# Altium schematic sheet MCU_and_Antenna.SchDoc (part 1 of 2)
size A4; Organization: My Company; Address1: Address Line 1; Address2: Address Line 2; Address3: Address Line 3; Address4: Address Line 4; SheetNumber: 4; SheetTotal: 6
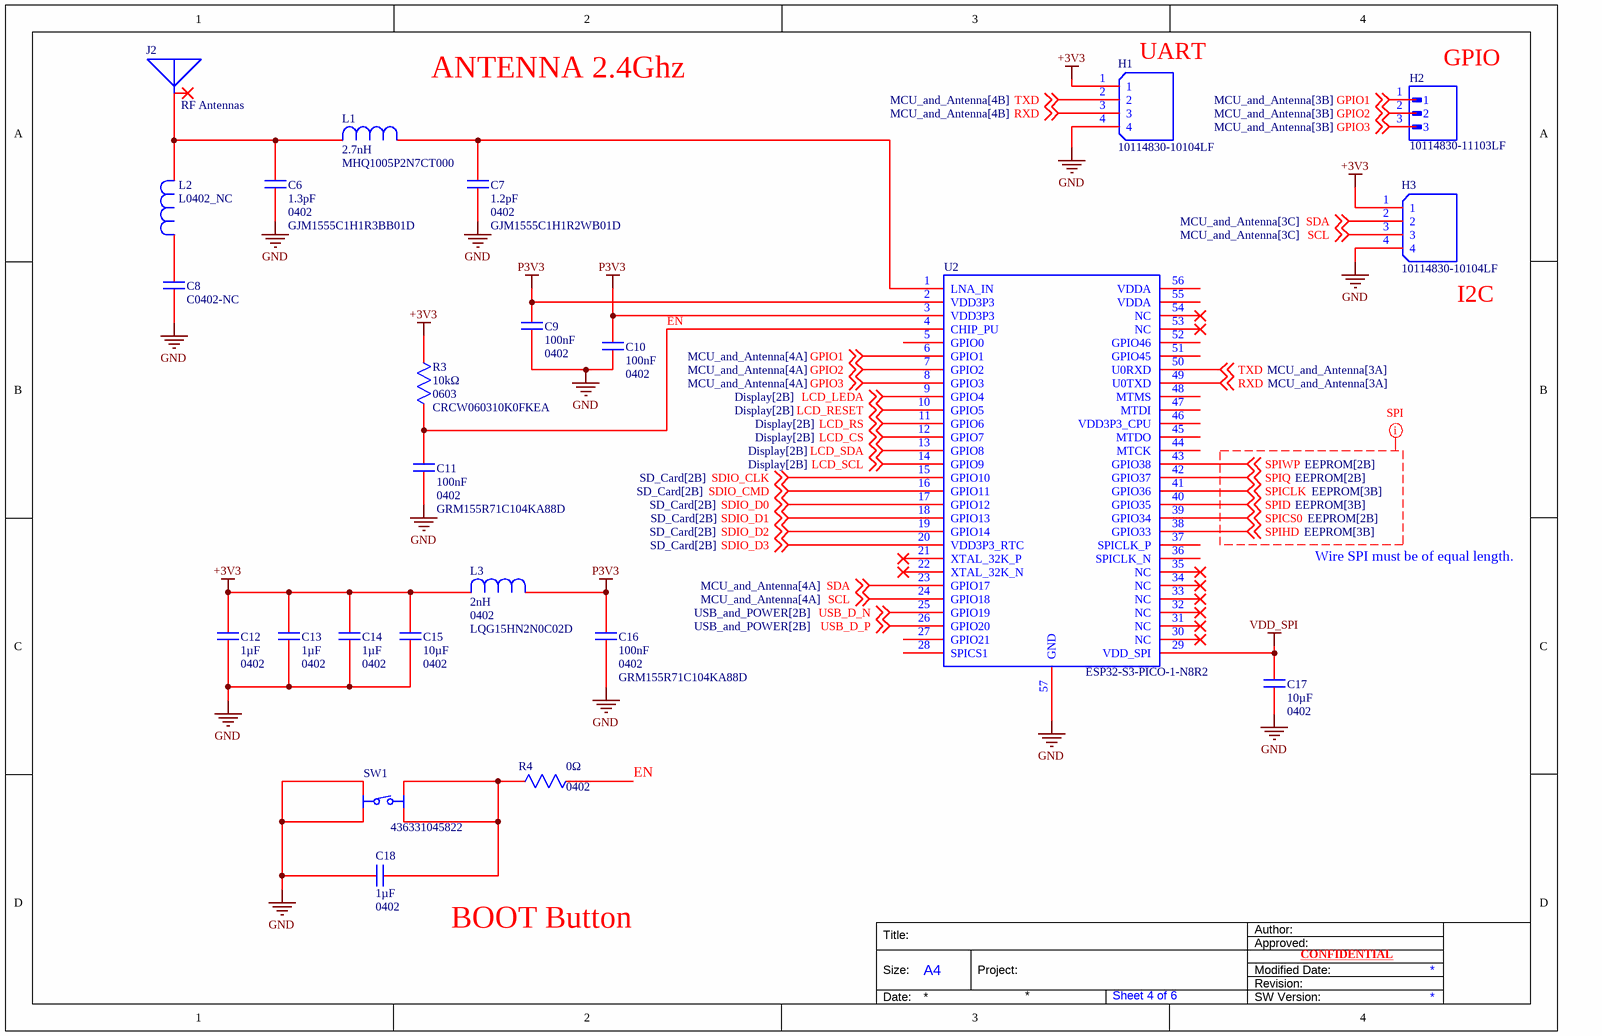
[diagram p0: MCU_and_Antenna.SchDoc]

## Parts
C6  GJM1555C1H1R3BB01D  value 1.3pF  Case Code (Imperial): 0402  [CAPC1005X55N]
C7  GJM1555C1H1R2WB01D  value 1.2pF  Case/Package: 0402  [CAPC1005X55N]
C8  C0402-NC  [CAPC1005X55N - NC]
C9  value 100nF  Case/Package: 0402  [CAPC1005X55N]  (hidden comment: GRM155R71C104KA88D)
C10  value 100nF  Case/Package: 0402  [CAPC1005X55N]  (hidden comment: GRM155R71C104KA88D)
C11  GRM155R71C104KA88D  value 100nF  Case/Package: 0402  [CAPC1005X55N]
C12  value 1µF  Case/Package: 0402  [CAPC1005X55N]  (hidden comment: CL05A105KP5NNNC)
C13  value 1µF  Case/Package: 0402  [CAPC1005X55N]  (hidden comment: CL05A105KP5NNNC)
C14  value 1µF  Case/Package: 0402  [CAPC1005X55N]  (hidden comment: CL05A105KP5NNNC)
C15  value 10µF  Case/Package: 0402  [CAPC1005X55N]  (hidden comment: GRM155R60J106ME15D)
C16  GRM155R71C104KA88D  value 100nF  Case/Package: 0402  [CAPC1005X55N]
C17  value 10µF  Case/Package: 0402  [CAPC1005X55N]  (hidden comment: GRM155R60J106ME15D)
C18  value 1µF  Case/Package: 0402  [CAPC1005X55N]  (hidden comment: CL05A105KP5NNNC)
H1  10114830-10104LF  [AMPHENOL_10114830-10104LF]
H2  10114830-11103LF  [AMPHENOL_10114830-11103LF]
H3  10114830-10104LF  [AMPHENOL_10114830-10104LF]
J2  RF Antennas  [ANT3216LL00R2400A]
L1  MHQ1005P2N7CT000  value 2.7nH  [IND_1005_TDK]
L2  L0402_NC  [IND_1005_TDK_NC]
L3  LQG15HN2N0C02D  value 2nH  Case/Package: 0402  [INDC1005X55N]
R3  CRCW060310K0FKEA  value 10kΩ  Case Code (Imperial): 0603  [RES_CRCW_0603]
R4  value 0Ω  Case/Package: 0402  [RC0402N_YAG-M]  (hidden comment: RC0402JR-070RL)
SW1  436331045822  [436331045822]
U2  ESP32-S3-PICO-1-N8R2  [QFN56_7X7_EXP-L]

## Nets
+3V3: C12.2 C13.2 C14.2 C15.2 H1.1 H3.1 L3.2 R3.1
GND: C6.1 C7.1 C8.1 C9.2 C10.2 C11.2 C12.1 C13.1 C14.1 C15.1 C16.2 C17.1 C18.2 H1.4 H3.4 SW1.1 SW1.3 U2.57(GND)
P3V3: C9.1 C10.1 C16.1 L3.1 U2.2(VDD3P3) U2.3(VDD3P3)
VDD_SPI: C17.2 U2.29(VDD_SPI)
EN: C11.1 R3.2 R4.2 U2.4(CHIP_PU)
GPIO1: H2.1 U2.6(GPIO1) ; off-sheet GPIO1
GPIO2: H2.2 U2.7(GPIO2) ; off-sheet GPIO2
GPIO3: H2.3 U2.8(GPIO3) ; off-sheet GPIO3
LCD_CS: U2.12(GPIO7) ; off-sheet LCD_CS
LCD_LEDA: U2.9(GPIO4) ; off-sheet LCD_LEDA
LCD_RESET: U2.10(GPIO5) ; off-sheet LCD_RESET
LCD_RS: U2.11(GPIO6) ; off-sheet LCD_RS
LCD_SCL: U2.14(GPIO9) ; off-sheet LCD_SCL
LCD_SDA: U2.13(GPIO8) ; off-sheet LCD_SDA
RXD: H1.3 U2.49(U0TXD) ; off-sheet RXD
SCL: H3.3 U2.24(GPIO18) ; off-sheet SCL
SDA: H3.2 U2.23(GPIO17) ; off-sheet SDA
SDIO_CLK: U2.15(GPIO10) ; off-sheet SDIO_CLK
SDIO_CMD: U2.16(GPIO11) ; off-sheet SDIO_CMD
SDIO_D0: U2.17(GPIO12) ; off-sheet SDIO_D0
SDIO_D1: U2.18(GPIO13) ; off-sheet SDIO_D1
SDIO_D2: U2.19(GPIO14) ; off-sheet SDIO_D2
SDIO_D3: U2.20(VDD3P3_RTC) ; off-sheet SDIO_D3
SPICLK: U2.41(GPIO36) ; off-sheet SPICLK
SPICS0: U2.39(GPIO34) ; off-sheet SPICS0
SPID: U2.40(GPIO35) ; off-sheet SPID
SPIHD: U2.38(GPIO33) ; off-sheet SPIHD
SPIQ: U2.42(GPIO37) ; off-sheet SPIQ
SPIWP: U2.43(GPIO38) ; off-sheet SPIWP
TXD: H1.2 U2.50(U0RXD) ; off-sheet TXD
USB_D_N: U2.25(GPIO19) ; off-sheet USB_D_N
USB_D_P: U2.26(GPIO20) ; off-sheet USB_D_P
NetC6_2: C6.2 J2.1 L1.2 L2.1
NetC7_2: C7.2 L1.1 U2.1(LNA_IN)
NetC8_2: C8.2 L2.2
NetC18_1: C18.1 R4.1 SW1.2 SW1.4

Not connected (* = marked no-connect by the designer): J2 2*; U2 5(GPIO0) 21(XTAL_32K_P)* 22(XTAL_32K_N)* 27(GPIO21) 28(SPICS1) 30(NC)* 31(NC)* 32(NC)* 33(NC)* 34(NC)* 35(NC)* 36(SPICLK_N) 37(SPICLK_P) 44(MTCK) 45(MTDO) 46(VDD3P3_CPU) 47(MTDI) 48(MTMS) 51(GPIO45) 52(GPIO46) 53(NC)* 54(NC)* 55(VDDA) 56(VDDA)

## Layout directives
mark named SPI: SPICLK, SPICS0, SPID, SPIHD, SPIQ, SPIWP

## Notes on the sheet
- ANTENNA 2.4Ghz
- (near H1) UART
- (near H2) GPIO
- I2C
- Wire SPI must be of equal length.
- BOOT Button
- Author:
- Title:
- Size:
- A4
- Project:
- Approved:
- Revision:
- Modified Date:
- CONFIDENTIAL
- Date:
- SW Version:
## Library data of the parts
C6 = GJM1555C1H1R3BB01D: 50V 1.3pF C0G 0402 Multilayer Ceramic Capacitors MLCC - SMD/SMT ROHS; Manufacturer: Murata; Manufacturer Lifecycle Status: IN PRODUCTION; Temperature Coefficient: 30ppm/°C; Supplier: DigiKey; Supplier Part Number: 490-8086-1-ND; Manufacturer Part Number: GJM1555C1H1R3BB01D; RoHS: Compliant; Category: Ceramic Capacitors; Stock: 147628; Pricing: 1=0,1, 10=0,051, 50=0,035, 100=0,0302, 500=0,02198, 1000=0,01946, 2500=0,01682, 5000=0,01524 (USD); Case/Package: 0402; Case Code (Metric): 1005; Depth: 500µm; Dielectric: C0G; Dielectric Material: Ceramic; Export Control Classification Number (ECCN) Code: EAR99; Height: 500µm; Harmonized Tariff Schedule (HTS) Code: 8532.24.00.20; Introduction Date: 2008-02-22; Lead Free: Lead Free; Lead Pitch: 300µm; Length: 1mm; Lifecycle Status: Production; Material: Ceramic; Max Operating Temperature: 125°C; Min Operating Temperature: -55°C; Mounting Technology: Surface Mount; Pins: 2; Number of Terminals: 2; Radiation Hardening: No; REACH SVHC: Yes; Schedule B: 8532240020, 8532240020|8532240020|8532240020|8532240020|8532240020; Termination: SMD/SMT; Thickness: 500µm; Voltage Rating: 50V; Voltage Rating (DC): 50V; Width: 500µm; ComponentLink1URL: https://datasheet.octopart.com:443/GJM1555C1H1R3BB01D-Murata-datasheet-12515636.pdf?src-supplier=_legacy+Avnet; ComponentLink1Description: https://datasheet.octopart.com:443/GJM1555C1H1R3BB01D-Murata-datasheet-12515636.pdf?src-supplier=_legacy+Avnet; ComponentLink2URL: https://datasheet.octopart.com:443/GJM1555C1H1R3BB01D-Murata-datasheet-165579666.pdf?src-supplier=TME; ComponentLink2Description: https://datasheet.octopart.com:443/GJM1555C1H1R3BB01D-Murata-datasheet-165579666.pdf?src-supplier=TME; ComponentLink3URL: https://datasheet.octopart.com:443/GJM1555C1H1R3BB01D-Murata-datasheet-12511495.pdf?src-supplier=TME; ComponentLink3Description: https://datasheet.octopart.com:443/GJM1555C1H1R3BB01D-Murata-datasheet-12511495.pdf?src-supplier=TME; ComponentLink4URL: https://datasheet.octopart.com:443/GJM1555C1H1R3BB01D-Murata-datasheet-141266224.pdf?src-supplier=Ciiva; ComponentLink4Description: https://datasheet.octopart.com:443/GJM1555C1H1R3BB01D-Murata-datasheet-141266224.pdf?src-supplier=Ciiva; ComponentLink5URL: https://datasheet.octopart.com:443/GJM1555C1H1R3BB01D-Murata-datasheet-140665301.pdf?src-supplier=Ciiva; ComponentLink5Description: https://datasheet.octopart.com:443/GJM1555C1H1R3BB01D-Murata-datasheet-140665301.pdf?src-supplier=Ciiva; ComponentLink6URL: https://datasheet.octopart.com:443/GJM1555C1H1R3BB01D-Murata-datasheet-138724564.pdf?src-supplier=Ciiva; ComponentLink6Description: https://datasheet.octopart.com:443/GJM1555C1H1R3BB01D-Murata-datasheet-138724564.pdf?src-supplier=Ciiva; ComponentLink7URL: https://datasheet.octopart.com:443/GJM1555C1H1R3BB01D-Murata-datasheet-22122223.pdf?src-supplier=Future+Electronics; ComponentLink7Description: https://datasheet.octopart.com:443/GJM1555C1H1R3BB01D-Murata-datasheet-22122223.pdf?src-supplier=Future+Electronics; ComponentLink8URL: https://datasheet.octopart.com:443/GJM1555C1H1R3BB01D-Murata-datasheet-12510170.pdf?src-supplier=Future+Electronics; ComponentLink8Description: https://datasheet.octopart.com:443/GJM1555C1H1R3BB01D-Murata-datasheet-12510170.pdf?src-supplier=Future+Electronics; ComponentLink9URL: https://datasheet.octopart.com:443/GJM1555C1H1R3BB01D-Murata-datasheet-8517407.pdf?src-supplier=Future+Electronics; ComponentLink9Description: https://datasheet.octopart.com:443/GJM1555C1H1R3BB01D-Murata-datasheet-8517407.pdf?src-supplier=Future+Electronics; ComponentLink10URL: https://datasheet.octopart.com:443/GJM1555C1H1R3BB01D-Murata-datasheet-8387045.pdf?src-supplier=Future+Electronics; ComponentLink10Description: https://datasheet.octopart.com:443/GJM1555C1H1R3BB01D-Murata-datasheet-8387045.pdf?src-supplier=Future+Electronics; ComponentLink11URL: https://datasheet.octopart.com:443/GJM1555C1H1R3BB01D-Murata-datasheet-8324201.pdf?src-supplier=Future+Electronics; ComponentLink11Description: https://datasheet.octopart.com:443/GJM1555C1H1R3BB01D-Murata-datasheet-8324201.pdf?src-supplier=Future+Electronics; ComponentLink12URL: https://datasheet.octopart.com:443/GJM1555C1H1R3BB01D-Murata-datasheet-7628724.pdf?src-supplier=Future+Electronics; ComponentLink12Description: https://datasheet.octopart.com:443/GJM1555C1H1R3BB01D-Murata-datasheet-7628724.pdf?src-supplier=Future+Electronics; ComponentLink13URL: https://datasheet.octopart.com:443/GJM1555C1H1R3BB01D-Murata-datasheet-552801.pdf?src-supplier=Future+Electronics; ComponentLink13Description: https://datasheet.octopart.com:443/GJM1555C1H1R3BB01D-Murata-datasheet-552801.pdf?src-supplier=Future+Electronics; ComponentLink14URL: https://datasheet.octopart.com:443/GJM1555C1H1R3BB01D-Murata-datasheet-44781245.pdf?src-supplier=Future+Electronics; ComponentLink14Description: https://datasheet.octopart.com:443/GJM1555C1H1R3BB01D-Murata-datasheet-44781245.pdf?src-supplier=Future+Electronics; ComponentLink15URL: https://datasheet.octopart.com/GJM1555C1H1R3BB01D-Murata-datasheet-12515295.pdf; ComponentLink15Description: https://datasheet.octopart.com/GJM1555C1H1R3BB01D-Murata-datasheet-12515295.pdf; ComponentLink16URL: https://datasheet.octopart.com/GJM1555C1H1R3BB01D-Murata-datasheet-12510076.pdf; ComponentLink16Description: https://datasheet.octopart.com/GJM1555C1H1R3BB01D-Murata-datasheet-12510076.pdf; ComponentLink17URL: https://datasheet.octopart.com/GJM1555C1H1R3BB01D-Murata-datasheet-11978611.pdf; ComponentLink17Description: https://datasheet.octopart.com/GJM1555C1H1R3BB01D-Murata-datasheet-11978611.pdf; ComponentLink18URL: https://datasheet.octopart.com/GJM1555C1H1R3BB01D-Murata-datasheet-10025737.pdf; ComponentLink18Description: https://datasheet.octopart.com/GJM1555C1H1R3BB01D-Murata-datasheet-10025737.pdf; ComponentLink19URL: https://datasheet.octopart.com/GJM1555C1H1R3BB01D-Murata-datasheet-8819587.pdf; ComponentLink19Description: https://datasheet.octopart.com/GJM1555C1H1R3BB01D-Murata-datasheet-8819587.pdf; ComponentLink20URL: https://datasheet.octopart.com/GJM1555C1H1R3BB01D-Murata-datasheet-14405988.pdf; ComponentLink20Description: https://datasheet.octopart.com/GJM1555C1H1R3BB01D-Murata-datasheet-14405988.pdf; ComponentLink21URL: https://datasheet.octopart.com:443/GJM1555C1H1R3BB01D-Murata-datasheet-10124241.pdf?src-supplier=Farnell; ComponentLink21Description: https://datasheet.octopart.com:443/GJM1555C1H1R3BB01D-Murata-datasheet-10124241.pdf?src-supplier=Farnell; ComponentLink22URL: http://sigma.octopart.com:80/reach_statement/Murata-company-16.pdf?src-supplier=Compliance+Statements; ComponentLink22Description: http://sigma.octopart.com:80/reach_statement/Murata-company-16.pdf?src-supplier=Compliance+Statements; LCSC Part: C161309
C7 = GJM1555C1H1R2WB01D: 50V 1.2pF C0G 0402 Multilayer Ceramic Capacitors MLCC - SMD/SMT ROHS; Manufacturer: Murata; Manufacturer Lifecycle Status: IN PRODUCTION; Temperature Coefficient: 30ppm/°C; Supplier: DigiKey; Supplier Part Number: 490-11195-1-ND; Manufacturer Part Number: GJM1555C1H1R2WB01D; RoHS: Compliant; Category: Ceramic Capacitors; Stock: 139087; Pricing: 1=0,14, 10=0,076, 50=0,0532, 100=0,0462, 500=0,0344, 1000=0,03078, 2500=0,02696, 5000=0,02467 (USD); Case Code (Imperial): 0402; Case Code (Metric): 1005; Depth: 500µm; Dielectric: C0G; Dielectric Material: Ceramic; Export Control Classification Number (ECCN) Code: EAR99; Height: 500µm; Harmonized Tariff Schedule (HTS) Code: 8532.24.00.20; Introduction Date: 2008-02-22; Lead Free: Lead Free; Length: 1mm; Lifecycle Status: Production; Material: Ceramic; Max Operating Temperature: 125°C; Min Operating Temperature: -55°C; Mounting Technology: Surface Mount; Number of Terminals: 2; Radiation Hardening: No; REACH SVHC: Yes; Schedule B: 8532240020, 8532240020|8532240020|8532240020|8532240020|8532240020; Termination: SMD/SMT; Thickness: 500µm; Voltage: 50V; Voltage Rating: 50V; Voltage Rating (DC): 50V; Width: 500µm; ComponentLink1URL: https://datasheet.octopart.com:443/GJM1555C1H1R2WB01D-Murata-datasheet-96711496.pdf?src-supplier=element14+APAC; ComponentLink1Description: https://datasheet.octopart.com:443/GJM1555C1H1R2WB01D-Murata-datasheet-96711496.pdf?src-supplier=element14+APAC; ComponentLink2URL: https://datasheet.octopart.com:443/GJM1555C1H1R2WB01D-Murata-datasheet-165579666.pdf?src-supplier=TME; ComponentLink2Description: https://datasheet.octopart.com:443/GJM1555C1H1R2WB01D-Murata-datasheet-165579666.pdf?src-supplier=TME; ComponentLink3URL: https://datasheet.octopart.com:443/GJM1555C1H1R2WB01D-Murata-datasheet-141266224.pdf?src-supplier=Ciiva; ComponentLink3Description: https://datasheet.octopart.com:443/GJM1555C1H1R2WB01D-Murata-datasheet-141266224.pdf?src-supplier=Ciiva; ComponentLink4URL: https://datasheet.octopart.com:443/GJM1555C1H1R2WB01D-Murata-datasheet-140665300.pdf?src-supplier=Ciiva; ComponentLink4Description: https://datasheet.octopart.com:443/GJM1555C1H1R2WB01D-Murata-datasheet-140665300.pdf?src-supplier=Ciiva; ComponentLink5URL: https://datasheet.octopart.com:443/GJM1555C1H1R2WB01D-Murata-datasheet-138724563.pdf?src-supplier=Ciiva; ComponentLink5Description: https://datasheet.octopart.com:443/GJM1555C1H1R2WB01D-Murata-datasheet-138724563.pdf?src-supplier=Ciiva; ComponentLink6URL: https://datasheet.octopart.com:443/GJM1555C1H1R2WB01D-Murata-datasheet-22122223.pdf?src-supplier=Future+Electronics; ComponentLink6Description: https://datasheet.octopart.com:443/GJM1555C1H1R2WB01D-Murata-datasheet-22122223.pdf?src-supplier=Future+Electronics; ComponentLink7URL: https://datasheet.octopart.com:443/GJM1555C1H1R2WB01D-Murata-datasheet-12510170.pdf?src-supplier=Future+Electronics; ComponentLink7Description: https://datasheet.octopart.com:443/GJM1555C1H1R2WB01D-Murata-datasheet-12510170.pdf?src-supplier=Future+Electronics; ComponentLink8URL: https://datasheet.octopart.com:443/GJM1555C1H1R2WB01D-Murata-datasheet-12510323.pdf?src-supplier=Future+Electronics; ComponentLink8Description: https://datasheet.octopart.com:443/GJM1555C1H1R2WB01D-Murata-datasheet-12510323.pdf?src-supplier=Future+Electronics; ComponentLink9URL: https://datasheet.octopart.com:443/GJM1555C1H1R2WB01D-Murata-datasheet-8517407.pdf?src-supplier=Future+Electronics; ComponentLink9Description: https://datasheet.octopart.com:443/GJM1555C1H1R2WB01D-Murata-datasheet-8517407.pdf?src-supplier=Future+Electronics; ComponentLink10URL: https://datasheet.octopart.com:443/GJM1555C1H1R2WB01D-Murata-datasheet-8387045.pdf?src-supplier=Future+Electronics; ComponentLink10Description: https://datasheet.octopart.com:443/GJM1555C1H1R2WB01D-Murata-datasheet-8387045.pdf?src-supplier=Future+Electronics; ComponentLink11URL: https://datasheet.octopart.com:443/GJM1555C1H1R2WB01D-Murata-datasheet-8324201.pdf?src-supplier=Future+Electronics; ComponentLink11Description: https://datasheet.octopart.com:443/GJM1555C1H1R2WB01D-Murata-datasheet-8324201.pdf?src-supplier=Future+Electronics; ComponentLink12URL: https://datasheet.octopart.com:443/GJM1555C1H1R2WB01D-Murata-datasheet-7628724.pdf?src-supplier=Future+Electronics; ComponentLink12Description: https://datasheet.octopart.com:443/GJM1555C1H1R2WB01D-Murata-datasheet-7628724.pdf?src-supplier=Future+Electronics; ComponentLink13URL: https://datasheet.octopart.com:443/GJM1555C1H1R2WB01D-Murata-datasheet-552801.pdf?src-supplier=Future+Electronics; ComponentLink13Description: https://datasheet.octopart.com:443/GJM1555C1H1R2WB01D-Murata-datasheet-552801.pdf?src-supplier=Future+Electronics; ComponentLink14URL: https://datasheet.octopart.com:443/GJM1555C1H1R2WB01D-Murata-datasheet-44781244.pdf?src-supplier=Future+Electronics; ComponentLink14Description: https://datasheet.octopart.com:443/GJM1555C1H1R2WB01D-Murata-datasheet-44781244.pdf?src-supplier=Future+Electronics; ComponentLink15URL: https://datasheet.octopart.com/GJM1555C1H1R2WB01D-Murata-datasheet-12515295.pdf; ComponentLink15Description: https://datasheet.octopart.com/GJM1555C1H1R2WB01D-Murata-datasheet-12515295.pdf; ComponentLink16URL: https://datasheet.octopart.com/GJM1555C1H1R2WB01D-Murata-datasheet-12510076.pdf; ComponentLink16Description: https://datasheet.octopart.com/GJM1555C1H1R2WB01D-Murata-datasheet-12510076.pdf; ComponentLink17URL: https://datasheet.octopart.com/GJM1555C1H1R2WB01D-Murata-datasheet-11978611.pdf; ComponentLink17Description: https://datasheet.octopart.com/GJM1555C1H1R2WB01D-Murata-datasheet-11978611.pdf; ComponentLink18URL: https://datasheet.octopart.com/GJM1555C1H1R2WB01D-Murata-datasheet-10025737.pdf; ComponentLink18Description: https://datasheet.octopart.com/GJM1555C1H1R2WB01D-Murata-datasheet-10025737.pdf; ComponentLink19URL: https://datasheet.octopart.com/GJM1555C1H1R2WB01D-Murata-datasheet-8819587.pdf; ComponentLink19Description: https://datasheet.octopart.com/GJM1555C1H1R2WB01D-Murata-datasheet-8819587.pdf; ComponentLink20URL: https://datasheet.octopart.com/GJM1555C1H1R2WB01D-Murata-datasheet-14405976.pdf; ComponentLink20Description: https://datasheet.octopart.com/GJM1555C1H1R2WB01D-Murata-datasheet-14405976.pdf; ComponentLink21URL: http://sigma.octopart.com:80/reach_statement/Murata-company-16.pdf?src-supplier=Compliance+Statements; ComponentLink21Description: http://sigma.octopart.com:80/reach_statement/Murata-company-16.pdf?src-supplier=Compliance+Statements; LCSC Part: C76899
C9-C11 C16 = GRM155R71C104KA88D: 16V 100nF X7R ±10% 0402 Multilayer Ceramic Capacitors MLCC - SMD/SMT ROHS; Manufacturer: Murata; Manufacturer Lifecycle Status: NRND; Insulation Resistance: 10GΩ; Supplier: DigiKey; Supplier Part Number: 490-3261-1-ND; Manufacturer Part Number: GRM155R71C104KA88D; RoHS: Compliant; Category: Ceramic Capacitors; Stock: 10363582; Pricing: 1=0,1, 10=0,024, 50=0,0156, 100=0,0132, 500=0,00926, 1000=0,00805, 2500=0,00678, 5000=0,00602 (USD); Case Code (Imperial): 0402; Case Code (Metric): 1005; Country of Origin: Japan, Mainland China, Philippines, Singapore, Thailand; Depth: 500µm; Dielectric: X7R; Dielectric Material: Ceramic; Export Control Classification Number (ECCN) Code: EAR99; Height: 500µm; Harmonized Tariff Schedule (HTS) Code: 8532.24.00.20; Introduction Date: 2004-11-19; Lead Free: Lead Free; Length: 1mm; Lifecycle Status: NRND; Material: Ceramic; Max Operating Temperature: 125°C; Min Operating Temperature: -55°C; Mounting Technology: Surface Mount; Pins: 2; Number of Terminals: 2; Packaging: Cut Tape; Radiation Hardening: No; REACH SVHC: Yes; Schedule B: 8532240020, 8532240020|8532240020|8532240020|8532240020|8532240020|8532240020|8532240020|8532240020|8532240020|8532240020|8532240020|8532240020|8532240020, 8532240020|8532240020|8532240020|8532240020|8532240020|8532240020|8532240020|8532240020|8532240020|8532240020|8532240020|8532240020|8532240020|8532240020, 8532240020|8532240020|8532240020|8532240020|8532240020|8532240020|8532240020|8532240020|8532240020|8532240020|8532240020|8532240020|8532240020|8532240020|8532240020; Termination: SMD/SMT; Thickness: 500µm; Tolerance: 10%; Voltage: 16V; Voltage Rating: 16V; Voltage Rating (DC): 16V; Width: 500µm; ComponentLink1URL: https://datasheet.octopart.com:443/GRM155R71C104KA88D-Murata-datasheet-6387203.pdf?src-supplier=Upverter; ComponentLink1Description: https://datasheet.octopart.com:443/GRM155R71C104KA88D-Murata-datasheet-6387203.pdf?src-supplier=Upverter; ComponentLink2URL: https://datasheet.octopart.com:443/GRM155R71C104KA88D-Murata-datasheet-501912.pdf?src-supplier=Farnell; ComponentLink2Description: https://datasheet.octopart.com:443/GRM155R71C104KA88D-Murata-datasheet-501912.pdf?src-supplier=Farnell; ComponentLink3URL: https://datasheet.octopart.com:443/GRM155R71C104KA88D-Murata-datasheet-62320226.pdf?src-supplier=Farnell; ComponentLink3Description: https://datasheet.octopart.com:443/GRM155R71C104KA88D-Murata-datasheet-62320226.pdf?src-supplier=Farnell; ComponentLink4URL: https://datasheet.octopart.com:443/GRM155R71C104KA88D-Murata-datasheet-514334.pdf?src-supplier=Farnell; ComponentLink4Description: https://datasheet.octopart.com:443/GRM155R71C104KA88D-Murata-datasheet-514334.pdf?src-supplier=Farnell; ComponentLink5URL: https://datasheet.octopart.com:443/GRM155R71C104KA88D-Murata-datasheet-165579666.pdf?src-supplier=TME; ComponentLink5Description: https://datasheet.octopart.com:443/GRM155R71C104KA88D-Murata-datasheet-165579666.pdf?src-supplier=TME; ComponentLink6URL: https://datasheet.octopart.com:443/GRM155R71C104KA88D-Murata-datasheet-81455578.pdf?src-supplier=TME; ComponentLink6Description: https://datasheet.octopart.com:443/GRM155R71C104KA88D-Murata-datasheet-81455578.pdf?src-supplier=TME; ComponentLink7URL: https://datasheet.octopart.com:443/GRM155R71C104KA88D-Murata-datasheet-59876780.pdf?src-supplier=TME; ComponentLink7Description: https://datasheet.octopart.com:443/GRM155R71C104KA88D-Murata-datasheet-59876780.pdf?src-supplier=TME; ComponentLink8URL: https://datasheet.octopart.com:443/GRM155R71C104KA88D-Murata-datasheet-141266224.pdf?src-supplier=Ciiva; ComponentLink8Description: https://datasheet.octopart.com:443/GRM155R71C104KA88D-Murata-datasheet-141266224.pdf?src-supplier=Ciiva; ComponentLink9URL: https://datasheet.octopart.com:443/GRM155R71C104KA88D-Murata-datasheet-140690972.pdf?src-supplier=Ciiva; ComponentLink9Description: https://datasheet.octopart.com:443/GRM155R71C104KA88D-Murata-datasheet-140690972.pdf?src-supplier=Ciiva; ComponentLink10URL: https://datasheet.octopart.com:443/GRM155R71C104KA88D-Murata-datasheet-138740890.pdf?src-supplier=Ciiva; ComponentLink10Description: https://datasheet.octopart.com:443/GRM155R71C104KA88D-Murata-datasheet-138740890.pdf?src-supplier=Ciiva; ComponentLink11URL: https://datasheet.octopart.com:443/GRM155R71C104KA88D-Murata-datasheet-120101189.pdf?src-supplier=Megastar; ComponentLink11Description: https://datasheet.octopart.com:443/GRM155R71C104KA88D-Murata-datasheet-120101189.pdf?src-supplier=Megastar; ComponentLink12URL: https://datasheet.octopart.com:443/GRM155R71C104KA88D-Murata-datasheet-96971104.pdf?src-supplier=Future+Electronics; ComponentLink12Description: https://datasheet.octopart.com:443/GRM155R71C104KA88D-Murata-datasheet-96971104.pdf?src-supplier=Future+Electronics; ComponentLink13URL: https://datasheet.octopart.com:443/GRM155R71C104KA88D-Murata-datasheet-22122223.pdf?src-supplier=Future+Electronics; ComponentLink13Description: https://datasheet.octopart.com:443/GRM155R71C104KA88D-Murata-datasheet-22122223.pdf?src-supplier=Future+Electronics; ComponentLink14URL: https://datasheet.octopart.com:443/GRM155R71C104KA88D-Murata-datasheet-14400564.pdf?src-supplier=Future+Electronics; ComponentLink14Description: https://datasheet.octopart.com:443/GRM155R71C104KA88D-Murata-datasheet-14400564.pdf?src-supplier=Future+Electronics; ComponentLink15URL: https://datasheet.octopart.com:443/GRM155R71C104KA88D-Murata-datasheet-44106293.pdf?src-supplier=Future+Electronics; ComponentLink15Description: https://datasheet.octopart.com:443/GRM155R71C104KA88D-Murata-datasheet-44106293.pdf?src-supplier=Future+Electronics; ComponentLink16URL: https://datasheet.octopart.com/GRM155R71C104KA88D-Murata-datasheet-12515295.pdf; ComponentLink16Description: https://datasheet.octopart.com/GRM155R71C104KA88D-Murata-datasheet-12515295.pdf; ComponentLink17URL: https://datasheet.octopart.com/GRM155R71C104KA88D-Murata-datasheet-12510076.pdf; ComponentLink17Description: https://datasheet.octopart.com/GRM155R71C104KA88D-Murata-datasheet-12510076.pdf; ComponentLink18URL: https://datasheet.octopart.com/GRM155R71C104KA88D-Murata-datasheet-11978611.pdf; ComponentLink18Description: https://datasheet.octopart.com/GRM155R71C104KA88D-Murata-datasheet-11978611.pdf; ComponentLink19URL: https://datasheet.octopart.com/GRM155R71C104KA88D-Murata-datasheet-10025737.pdf; ComponentLink19Description: https://datasheet.octopart.com/GRM155R71C104KA88D-Murata-datasheet-10025737.pdf; ComponentLink20URL: https://datasheet.octopart.com/GRM155R71C104KA88D-Murata-datasheet-8819587.pdf; ComponentLink20Description: https://datasheet.octopart.com/GRM155R71C104KA88D-Murata-datasheet-8819587.pdf; ComponentLink21URL: https://datasheet.octopart.com/GRM155R71C104KA88D-Murata-datasheet-12555248.pdf; ComponentLink21Description: https://datasheet.octopart.com/GRM155R71C104KA88D-Murata-datasheet-12555248.pdf; ComponentLink22URL: https://datasheet.octopart.com:443/GRM155R71C104KA88D-Murata-datasheet-11864723.pdf?src-supplier=Arrow+Electronics; ComponentLink22Description: https://datasheet.octopart.com:443/GRM155R71C104KA88D-Murata-datasheet-11864723.pdf?src-supplier=Arrow+Electronics; ComponentLink23URL: https://datasheet.octopart.com:443/GRM155R71C104KA88D-Murata-datasheet-148211.pdf?src-supplier=Garrett; ComponentLink23Description: https://datasheet.octopart.com:443/GRM155R71C104KA88D-Murata-datasheet-148211.pdf?src-supplier=Garrett; ComponentLink24URL: https://datasheet.octopart.com:443/GRM155R71C104KA88D-Murata-datasheet-118811.pdf?src-supplier=DigiKey; ComponentLink24Description: https://datasheet.octopart.com:443/GRM155R71C104KA88D-Murata-datasheet-118811.pdf?src-supplier=DigiKey; ComponentLink25URL: https://datasheet.octopart.com:443/GRM155R71C104KA88D-Murata-datasheet-38265814.pdf?src-supplier=Newark; ComponentLink25Description: https://datasheet.octopart.com:443/GRM155R71C104KA88D-Murata-datasheet-38265814.pdf?src-supplier=Newark; ComponentLink26URL: http://sigma.octopart.com:80/reach_statement/Murata-company-16.pdf?src-supplier=Compliance+Statements; ComponentLink26Description: http://sigma.octopart.com:80/reach_statement/Murata-company-16.pdf?src-supplier=Compliance+Statements; LCSC Part: C71629
C12-C14 C18 = CL05A105KP5NNNC: 10V 1uF X5R 卤10% 0402 Multilayer Ceramic Capacitors MLCC - SMD/SMT ROHS; Manufacturer: Samsung Electro-Mechanics; Tolerance: 10%; Supplier: DigiKey; Supplier Part Number: 1276-1076-2-ND; Manufacturer Part Number: CL05A105KP5NNNC; RoHS: Compliant; Category: Ceramic Capacitors; Stock: 6461612; Pricing: 10000=0,00534, 20000=0,00483, 30000=0,00457, 50000=0,00429, 70000=0,00413, 100000=0,00397 (USD); Case Code (Imperial): 0402; Case Code (Metric): 1005; China RoHS: Compliant; Contact Plating: Tin; Country of Origin: Mainland China, Philippines, South Korea; Depth: 500µm; Dielectric: X5R; Dielectric Material: Ceramic; Export Control Classification Number (ECCN) Code: EAR99; Height: 550µm; Harmonized Tariff Schedule (HTS) Code: 8532.24.00.20; Introduction Date: 2007-12-03; Length: 1mm; Lifecycle Status: Production; Material: Ceramic; Max Operating Temperature: 85°C; Min Operating Temperature: -55°C; Mounting Technology: Surface Mount; Number of Terminals: 2; Radiation Hardening: No; REACH SVHC: Yes; Schedule B: 8532240020, 8532240020|8532240020|8532240020|8532240020|8532240020, 8532240020|8532240020|8532240020|8532240020|8532240020|8532240020, 8532240020|8532240020|8532240020|8532240020|8532240020|8532240020|8532240020; Thickness: 558.8µm; Voltage Rating: 10V; Voltage Rating (DC): 10V; Width: 500µm; ComponentLink1URL: https://datasheet.octopart.com:443/CL05A105KP5NNNC-Samsung-Electro-Mechanics-datasheet-181960517.pdf?src-supplier=IHS; ComponentLink1Description: https://datasheet.octopart.com:443/CL05A105KP5NNNC-Samsung-Electro-Mechanics-datasheet-181960517.pdf?src-supplier=IHS; ComponentLink2URL: https://datasheet.octopart.com:443/CL05A105KP5NNNC-Samsung-Electro-Mechanics-datasheet-136031721.pdf?src-supplier=Future+Electronics; ComponentLink2Description: https://datasheet.octopart.com:443/CL05A105KP5NNNC-Samsung-Electro-Mechanics-datasheet-136031721.pdf?src-supplier=Future+Electronics; ComponentLink3URL: https://datasheet.octopart.com:443/CL05A105KP5NNNC-Samsung-Electro-Mechanics-datasheet-110226203.pdf?src-supplier=Future+Electronics; ComponentLink3Description: https://datasheet.octopart.com:443/CL05A105KP5NNNC-Samsung-Electro-Mechanics-datasheet-110226203.pdf?src-supplier=Future+Electronics; ComponentLink4URL: https://datasheet.octopart.com:443/CL05A105KP5NNNC-Samsung-Electro-Mechanics-datasheet-81461591.pdf?src-supplier=Future+Electronics; ComponentLink4Description: https://datasheet.octopart.com:443/CL05A105KP5NNNC-Samsung-Electro-Mechanics-datasheet-81461591.pdf?src-supplier=Future+Electronics; ComponentLink5URL: https://datasheet.octopart.com:443/CL05A105KP5NNNC-Samsung-datasheet-42280521.pdf?src-supplier=Future+Electronics; ComponentLink5Description: https://datasheet.octopart.com:443/CL05A105KP5NNNC-Samsung-datasheet-42280521.pdf?src-supplier=Future+Electronics; ComponentLink6URL: https://datasheet.octopart.com:443/CL05A105KP5NNNC-Samsung-datasheet-26589000.pdf?src-supplier=Future+Electronics; ComponentLink6Description: https://datasheet.octopart.com:443/CL05A105KP5NNNC-Samsung-datasheet-26589000.pdf?src-supplier=Future+Electronics; ComponentLink7URL: https://datasheet.octopart.com:443/CL05A105KP5NNNC-Samsung-datasheet-8326907.pdf?src-supplier=Future+Electronics; ComponentLink7Description: https://datasheet.octopart.com:443/CL05A105KP5NNNC-Samsung-datasheet-8326907.pdf?src-supplier=Future+Electronics; ComponentLink8URL: https://datasheet.octopart.com:443/CL05A105KP5NNNC-Samsung-Electro-Mechanics-datasheet-149136634.pdf?src-supplier=Future+Electronics; ComponentLink8Description: https://datasheet.octopart.com:443/CL05A105KP5NNNC-Samsung-Electro-Mechanics-datasheet-149136634.pdf?src-supplier=Future+Electronics; ComponentLink9URL: https://datasheet.octopart.com/CL05A105KP5NNNC-Samsung-Electro-Mechanics-datasheet-97040617.pdf; ComponentLink9Description: https://datasheet.octopart.com/CL05A105KP5NNNC-Samsung-Electro-Mechanics-datasheet-97040617.pdf; ComponentLink10URL: https://datasheet.octopart.com/CL05A105KP5NNNC-Samsung-Electro-Mechanics-datasheet-8324245.pdf; ComponentLink10Description: https://datasheet.octopart.com/CL05A105KP5NNNC-Samsung-Electro-Mechanics-datasheet-8324245.pdf; ComponentLink11URL: https://datasheet.octopart.com:443/CL05A105KP5NNNC-Samsung-Electro-Mechanics-datasheet-11789578.pdf?src-supplier=Arrow+Electronics; ComponentLink11Description: https://datasheet.octopart.com:443/CL05A105KP5NNNC-Samsung-Electro-Mechanics-datasheet-11789578.pdf?src-supplier=Arrow+Electronics; ComponentLink12URL: https://datasheet.octopart.com:443/CL05A105KP5NNNC-Samsung-datasheet-59220082.pdf?src-supplier=TME; ComponentLink12Description: https://datasheet.octopart.com:443/CL05A105KP5NNNC-Samsung-datasheet-59220082.pdf?src-supplier=TME; LCSC Part: C14445
C15 C17 = GRM155R60J106ME15D: 6.3V 10uF X5R ±20% 0402 Multilayer Ceramic Capacitors MLCC - SMD/SMT ROHS; Manufacturer: Murata; Manufacturer Lifecycle Status: IN PRODUCTION; Supplier: DigiKey; Supplier Part Number: 490-13238-6-ND; Manufacturer Part Number: GRM155R60J106ME15D; RoHS: Compliant; Category: Ceramic Capacitors; Stock: 101484; Pricing: 1=0,16, 10=0,088, 50=0,0618, 100=0,0538, 500=0,04036, 1000=0,03624, 2500=0,0319, 5000=0,02929 (USD); Case Code (Imperial): 0402; Case Code (Metric): 1005; Dielectric: X5R; Dielectric Material: Ceramic; Height: 500µm; Length: 1mm; Lifecycle Status: Production; Material: Ceramic; Max Operating Temperature: 85°C; Min Operating Temperature: -55°C; Mounting Technology: Surface Mount; Number of Terminals: 2; REACH SVHC: Yes; Schedule B: 8532240020, 8532240020|8532240020, 8532240020|8532240020|8532240020, 8532240020|8532240020|8532240020|8532240020; Thickness: 500µm; Tolerance: 20%; Voltage Rating: 6.3V; Voltage Rating (DC): 6.3V; Width: 500µm; ComponentLink1URL: https://datasheet.octopart.com:443/GRM155R60J106ME15D-Murata-datasheet-149522992.pdf?src-supplier=Newark; ComponentLink1Description: https://datasheet.octopart.com:443/GRM155R60J106ME15D-Murata-datasheet-149522992.pdf?src-supplier=Newark; ComponentLink2URL: https://datasheet.octopart.com:443/GRM155R60J106ME15D-Murata-datasheet-165579666.pdf?src-supplier=TME; ComponentLink2Description: https://datasheet.octopart.com:443/GRM155R60J106ME15D-Murata-datasheet-165579666.pdf?src-supplier=TME; ComponentLink3URL: https://datasheet.octopart.com:443/GRM155R60J106ME15D-Murata-datasheet-141266224.pdf?src-supplier=Ciiva; ComponentLink3Description: https://datasheet.octopart.com:443/GRM155R60J106ME15D-Murata-datasheet-141266224.pdf?src-supplier=Ciiva; ComponentLink4URL: https://datasheet.octopart.com:443/GRM155R60J106ME15D-Murata-datasheet-140689297.pdf?src-supplier=Ciiva; ComponentLink4Description: https://datasheet.octopart.com:443/GRM155R60J106ME15D-Murata-datasheet-140689297.pdf?src-supplier=Ciiva; ComponentLink5URL: https://datasheet.octopart.com:443/GRM155R60J106ME15D-Murata-datasheet-138740639.pdf?src-supplier=Ciiva; ComponentLink5Description: https://datasheet.octopart.com:443/GRM155R60J106ME15D-Murata-datasheet-138740639.pdf?src-supplier=Ciiva; ComponentLink6URL: https://datasheet.octopart.com:443/GRM155R60J106ME15D-Murata-datasheet-102370999.pdf?src-supplier=HQonline; ComponentLink6Description: https://datasheet.octopart.com:443/GRM155R60J106ME15D-Murata-datasheet-102370999.pdf?src-supplier=HQonline; ComponentLink7URL: https://datasheet.octopart.com/GRM155R60J106ME15D-Murata-datasheet-12515295.pdf; ComponentLink7Description: https://datasheet.octopart.com/GRM155R60J106ME15D-Murata-datasheet-12515295.pdf; ComponentLink8URL: https://datasheet.octopart.com/GRM155R60J106ME15D-Murata-datasheet-12510076.pdf; ComponentLink8Description: https://datasheet.octopart.com/GRM155R60J106ME15D-Murata-datasheet-12510076.pdf; ComponentLink9URL: https://datasheet.octopart.com/GRM155R60J106ME15D-Murata-datasheet-11978611.pdf; ComponentLink9Description: https://datasheet.octopart.com/GRM155R60J106ME15D-Murata-datasheet-11978611.pdf; ComponentLink10URL: https://datasheet.octopart.com/GRM155R60J106ME15D-Murata-datasheet-10025737.pdf; ComponentLink10Description: https://datasheet.octopart.com/GRM155R60J106ME15D-Murata-datasheet-10025737.pdf; ComponentLink11URL: https://datasheet.octopart.com/GRM155R60J106ME15D-Murata-datasheet-8819587.pdf; ComponentLink11Description: https://datasheet.octopart.com/GRM155R60J106ME15D-Murata-datasheet-8819587.pdf; ComponentLink12URL: http://sigma.octopart.com:80/reach_statement/Murata-company-16.pdf?src-supplier=Compliance+Statements; ComponentLink12Description: http://sigma.octopart.com:80/reach_statement/Murata-company-16.pdf?src-supplier=Compliance+Statements; LCSC Part: C412251
H1 H3 = 10114830-10104LF: Board Connector, 4 Contact(S), 1 Row(S), Male, Right Angle, 0.049 Inch Pitch, Surface Mount; Manufacturer: Amphenol Communications Solutions; Connector Type: Male Pin; Contact Resistance: 20mΩ; Current Rating: 1A; Dielectric Material: Liquid Crystal Polymer; Insulation Resistance: 100MΩ; Max Voltage Rating (AC): 125V; Number of Contacts: 4; Operating Force: 29.42N; Pitch: 1.2446mm; Plating Thickness: 2.54µm; Supplier: DigiKey; Supplier Part Number: 609-6047-1-ND; Manufacturer Part Number: 10114830-10104LF; RoHS: Compliant; Category: Headers and Wire Housings; Stock: 13344; Pricing: 1=0,49, 10=0,42, 100=0,3569, 500=0,31854 (USD); China RoHS: Compliant; Color: Natural; Contact Gender: Male; Contact Material: Bronze; Contact Plating: Tin; Depth: 5.3mm; Export Control Classification Number (ECCN) Code: EAR99; Flammability Rating: UL94 V-0; Gender: Male; Housing Color: Natural; Housing Material: Thermoplastic; Harmonized Tariff Schedule (HTS) Code: 8536.69.40.40; Introduction Date: 2010-12-14; Length: 10.15mm; Lifecycle Status: Production; Max Current Rating: 1A; Max Operating Temperature: 105°C; Min Operating Temperature: -40°C; Mounting Technology: Surface Mount; Pins: 4; Number of Positions: 4; Number of Rows: 1; Orientation: Right Angle; REACH SVHC: Yes; Schedule B: 8536694040, 8536694040|8536694040, 8536694040|8536694040|8536694040, 8536694040|8536694040|8536694040|8536694040; Terminal Pitch: 1.25mm; Termination: Solder; Voltage Rating: 125V; ComponentLink1URL: https://datasheet.octopart.com:443/10114830-10104LF-Amphenol-Communications-Solutions-datasheet-181954850.pdf?src-supplier=IHS; ComponentLink1Description: https://datasheet.octopart.com:443/10114830-10104LF-Amphenol-Communications-Solutions-datasheet-181954850.pdf?src-supplier=IHS; ComponentLink2URL: https://datasheet.octopart.com:443/10114830-10104LF-Amphenol-Communications-Solutions-datasheet-154727257.pdf?src-supplier=Electro+Sonic; ComponentLink2Description: https://datasheet.octopart.com:443/10114830-10104LF-Amphenol-Communications-Solutions-datasheet-154727257.pdf?src-supplier=Electro+Sonic; ComponentLink3URL: https://datasheet.octopart.com:443/10114830-10104LF-FCI-datasheet-11519768.pdf?src-supplier=element14+APAC; ComponentLink3Description: https://datasheet.octopart.com:443/10114830-10104LF-FCI-datasheet-11519768.pdf?src-supplier=element14+APAC; ComponentLink4URL: https://datasheet.octopart.com:443/10114830-10104LF-FCI-datasheet-62311819.pdf?src-supplier=Farnell; ComponentLink4Description: https://datasheet.octopart.com:443/10114830-10104LF-FCI-datasheet-62311819.pdf?src-supplier=Farnell; LCSC Part: C5407185
H2 = 10114830-11103LF: WTB 1.25 WAFER 90 SMT-10114830-11103LF | Amphenol FCI (Amphenol CS) 1011483011103LF; Manufacturer: Amphenol Communications Solutions; Connector Type: Male Pin; Contact Resistance: 20mΩ; Current Rating: 1A; Dielectric Material: Liquid Crystal Polymer; Gender: Male; Insulation Resistance: 100MΩ; Number of Positions: 3; Operating Force: 24.52N; Pitch: 1.2446mm; Supplier: DigiKey; Supplier Part Number: 609-10114830-11103LFDKR-ND; Manufacturer Part Number: 10114830-11103LF; RoHS: Compliant; Category: Card Edge Connectors; Stock: 6852; Pricing: 1=0,43, 10=0,365, 100=0,3097, 500=0,2764 (USD); China RoHS: Compliant; Color: Natural; Contact Plating: Gold; Lifecycle Status: Production; Max Operating Temperature: 105°C; Min Operating Temperature: -40°C; Mounting Technology: Surface Mount; Number of Rows: 1; Orientation: Right Angle; REACH SVHC: Yes; Terminal Pitch: 1.25mm; Termination: Solder; ComponentLink1URL: https://datasheet.octopart.com:443/10114830-11103LF-Amphenol-Communications-Solutions-datasheet-181954850.pdf?src-supplier=IHS; ComponentLink1Description: https://datasheet.octopart.com:443/10114830-11103LF-Amphenol-Communications-Solutions-datasheet-181954850.pdf?src-supplier=IHS; LCSC Part: C5407064
J2 = ANT3216LL00R2400A: CERAMIC HELIX CHIP ANTENNA, 433MHZ, 1204; Available until stocks are exhausted; Manufacturer: Yageo Group; Impedance: 50Ω; Clock Frequency: 2.5GHz; Supplier: DigiKey; Supplier Part Number: 311-4590-6-ND; Manufacturer Part Number: ANT3216LL00R2400A; RoHS: Compliant; Category: RF Antennas; Stock: 12714; Pricing: 1=0,46, 10=0,32, 25=0,2852, 100=0,2473, 250=0,22916, 500=0,21822, 1000=0,20921 (USD); Body Material: Ceramic; Country of Origin: Mainland China, Taiwan; Introduction Date: 2013-03-27; Lifecycle Status: Production; Max Operating Temperature: 105°C; Min Operating Temperature: -40°C; Mounting Technology: Surface Mount; Number of Terminals: 2; REACH SVHC: Yes; ComponentLink1URL: https://datasheet.octopart.com:443/ANT3216LL00R2400A-Pulse-datasheet-159152929.pdf?src-supplier=Electro+Sonic; ComponentLink1Description: https://datasheet.octopart.com:443/ANT3216LL00R2400A-Pulse-datasheet-159152929.pdf?src-supplier=Electro+Sonic; ComponentLink2URL: https://datasheet.octopart.com:443/ANT3216LL00R2400A-Yageo-datasheet-181541429.pdf?src-supplier=IHS; ComponentLink2Description: https://datasheet.octopart.com:443/ANT3216LL00R2400A-Yageo-datasheet-181541429.pdf?src-supplier=IHS; ComponentLink3URL: http://sigma.octopart.com:80/conflict_mineral_statement/Yageo-company-3.pdf?src-supplier=Compliance+Statements; ComponentLink3Description: http://sigma.octopart.com:80/conflict_mineral_statement/Yageo-company-3.pdf?src-supplier=Compliance+Statements; ComponentLink4URL: http://sigma.octopart.com:80/rohs_statement/Yageo-company-2.pdf?src-supplier=Compliance+Statements; ComponentLink4Description: http://sigma.octopart.com:80/rohs_statement/Yageo-company-2.pdf?src-supplier=Compliance+Statements; LCSC Part: C22423581
L1 = MHQ1005P2N7CT000: General Purpose Inductor, 0.0027uH, 7.4074%, 1 Element, Ceramic-Core, SMD, 0402; Manufacturer: TDK; Manufacturer Lifecycle Status: PRODUCTION; Current Rating: 900mA; DC Resistance (DCR): 70mΩ; Number of Circuits: 1; Q Factor: 23; Self Resonant Frequency: 6.5GHz; Shielding: Unshielded; Test Frequency: 100MHz; Tolerance: 0.07%; Supplier: DigiKey; Supplier Part Number: 445-172420-2-ND; Manufacturer Part Number: MHQ1005P2N7CT000; RoHS: Compliant; Category: Fixed Inductors; Stock: 10000; Pricing: 10000=0,05758, 20000=0,0543, 30000=0,05247, 50000=0,05025, 70000=0,04884, 100000=0,04739 (USD); Case/Package: 0402; Case Code (Imperial): 0402; Case Code (Metric): 1005; Core Material: Ceramic; Export Control Classification Number (ECCN) Code: EAR99; Height: 500µm; Height - Seated (Max): 609.6µm; Harmonized Tariff Schedule (HTS) Code: 8504.50.80.00; Introduction Date: 2013-10-01; Length: 1mm; Lifecycle Status: Production; Max Current Rating: 900mA; Max DC Current: 900mA; Max Length: 1.05mm; Max Operating Temperature: 125°C; Max Width: 650µm; Min Length: 950µm; Min Operating Temperature: -55°C; Min Width: 550µm; Mounting Technology: Surface Mount; Number of Terminals: 2; Packaging: Cut Tape (CT); REACH SVHC: Yes; Termination: SMD/SMT; Weight: 652.039032µg; Width: 600µm; ComponentLink1URL: https://datasheet.octopart.com:443/MHQ1005P2N7CT000-TDK-datasheet-181268076.pdf?src-supplier=IHS; ComponentLink1Description: https://datasheet.octopart.com:443/MHQ1005P2N7CT000-TDK-datasheet-181268076.pdf?src-supplier=IHS; ComponentLink2URL: https://datasheet.octopart.com:443/MHQ1005P2N7CT000-TDK-datasheet-155380095.pdf?src-supplier=ODG+(Origin+Data+Global); ComponentLink2Description: https://datasheet.octopart.com:443/MHQ1005P2N7CT000-TDK-datasheet-155380095.pdf?src-supplier=ODG+(Origin+Data+Global); ComponentLink3URL: https://datasheet.octopart.com:443/MHQ1005P2N7CT000-TDK-datasheet-136874815.pdf?src-supplier=TME; ComponentLink3Description: https://datasheet.octopart.com:443/MHQ1005P2N7CT000-TDK-datasheet-136874815.pdf?src-supplier=TME; ComponentLink4URL: https://datasheet.octopart.com:443/MHQ1005P2N7CT000-TDK-datasheet-41546101.pdf?src-supplier=Future+Electronics; ComponentLink4Description: https://datasheet.octopart.com:443/MHQ1005P2N7CT000-TDK-datasheet-41546101.pdf?src-supplier=Future+Electronics; LCSC Part: C434841
L3 = LQG15HN2N0C02D: General Purpose Inductor, 0.002uH, 10%, 1 Element, Reflow soldering, 1005/0402; Manufacturer: Murata; Manufacturer Lifecycle Status: IN PRODUCTION; Core Material: Air; Current Rating: 900mA; DC Resistance (DCR): 90mΩ; Number of Circuits: 1; Q Factor: 8; Self Resonant Frequency: 6GHz; Shielding: Unshielded; Test Frequency: 100MHz; Supplier: DigiKey; Supplier Part Number: 490-15076-6-ND; Manufacturer Part Number: LQG15HN2N0C02D; RoHS: Compliant; Category: Fixed Inductors; Stock: 65005; Pricing: 1=0,1, 10=0,045, 25=0,0416, 50=0,039, 100=0,0368, 250=0,03408, 500=0,03212, 1000=0,03028, 2500=0,02801 (USD); Country of Origin: Japan; Export Control Classification Number (ECCN) Code: EAR99; Height: 500µm; Harmonized Tariff Schedule (HTS) Code: 8504.50.80.00; Introduction Date: 2018-02-22; Length: 1mm; Lifecycle Status: Production; Max Current Rating: 900mA; Max Operating Temperature: 125°C; Min Operating Temperature: -55°C; Number of Terminals: 2; REACH SVHC: Yes; RMS Current (Irms): 900mA; Schedule B: 8504500000, 8504500000|8504500000|8504500000|8504500000|8504500000; ESR: 90mΩ; Tolerance: 10%; Width: 500µm; ComponentLink1URL: https://datasheet.octopart.com:443/LQG15HN2N0C02D-Murata-datasheet-141286051.pdf?src-supplier=Ciiva; ComponentLink1Description: https://datasheet.octopart.com:443/LQG15HN2N0C02D-Murata-datasheet-141286051.pdf?src-supplier=Ciiva; ComponentLink2URL: https://datasheet.octopart.com:443/LQG15HN2N0C02D-Murata-datasheet-140712106.pdf?src-supplier=Ciiva; ComponentLink2Description: https://datasheet.octopart.com:443/LQG15HN2N0C02D-Murata-datasheet-140712106.pdf?src-supplier=Ciiva; ComponentLink3URL: https://datasheet.octopart.com:443/LQG15HN2N0C02D-Murata-datasheet-138753224.pdf?src-supplier=Ciiva; ComponentLink3Description: https://datasheet.octopart.com:443/LQG15HN2N0C02D-Murata-datasheet-138753224.pdf?src-supplier=Ciiva; ComponentLink4URL: https://datasheet.octopart.com:443/LQG15HN2N0C02D-Murata-datasheet-142219898.pdf?src-supplier=Arrow.cn; ComponentLink4Description: https://datasheet.octopart.com:443/LQG15HN2N0C02D-Murata-datasheet-142219898.pdf?src-supplier=Arrow.cn; ComponentLink5URL: https://datasheet.octopart.com:443/LQG15HN2N0C02D-Murata-datasheet-140568920.pdf?src-supplier=Arrow.cn; ComponentLink5Description: https://datasheet.octopart.com:443/LQG15HN2N0C02D-Murata-datasheet-140568920.pdf?src-supplier=Arrow.cn; ComponentLink6URL: https://datasheet.octopart.com:443/LQG15HN2N0C02D-Murata-datasheet-145449623.pdf?src-supplier=Geoflip; ComponentLink6Description: https://datasheet.octopart.com:443/LQG15HN2N0C02D-Murata-datasheet-145449623.pdf?src-supplier=Geoflip; ComponentLink7URL: https://datasheet.octopart.com:443/LQG15HN2N0C02D-Murata-datasheet-140317006.pdf?src-supplier=Farnell; ComponentLink7Description: https://datasheet.octopart.com:443/LQG15HN2N0C02D-Murata-datasheet-140317006.pdf?src-supplier=Farnell; ComponentLink8URL: http://sigma.octopart.com:80/reach_statement/Murata-company-16.pdf?src-supplier=Compliance+Statements; ComponentLink8Description: http://sigma.octopart.com:80/reach_statement/Murata-company-16.pdf?src-supplier=Compliance+Statements; LCSC Part: C2043639